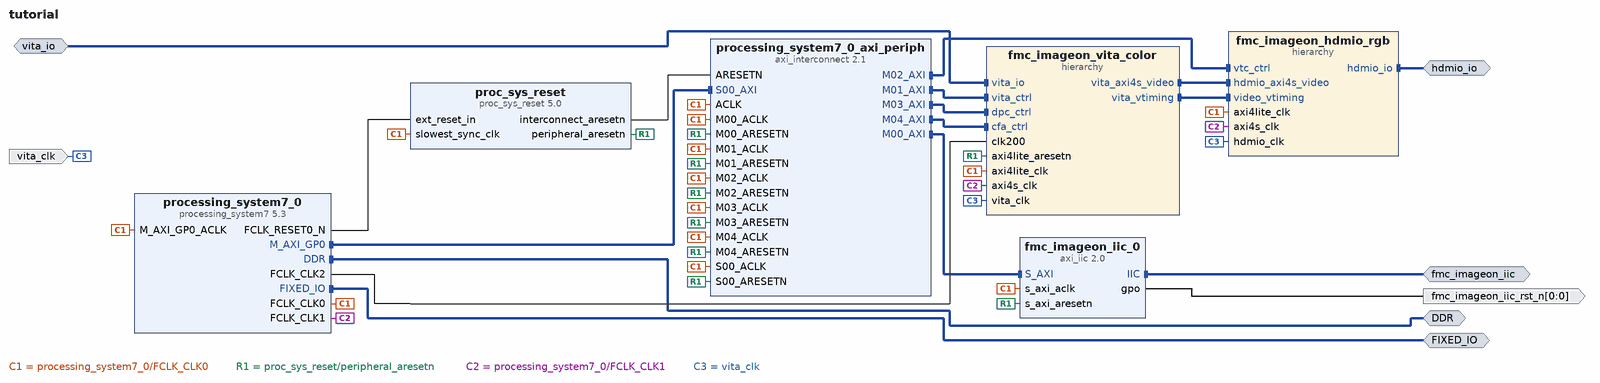
[diagram p0: block diagram of the top level]
# Vivado block design tutorial, Vivado 2013.3
create_bd_design tutorial

create_bd_intf_port -mode Master -vlnv xilinx.com:interface:ddrx_rtl:1.0 DDR
create_bd_intf_port -mode Master -vlnv xilinx.com:display_processing_system7:fixedio_rtl:1.0 FIXED_IO
create_bd_intf_port -mode Master -vlnv xilinx.com:interface:iic_rtl:1.0 fmc_imageon_iic
create_bd_intf_port -mode Slave -vlnv avnet.com:interface:avnet_vita_rtl:1.0 vita_io
create_bd_intf_port -mode Master -vlnv avnet.com:interface:avnet_hdmi_rtl:1.0 hdmio_io
create_bd_port -dir O -from 0 -to 0 fmc_imageon_iic_rst_n
create_bd_port -dir I vita_clk

create_bd_cell -type ip -vlnv xilinx.com:ip:processing_system7:5.3 processing_system7_0
set_property -dict [list \
  CONFIG.PCW_FPGA1_PERIPHERAL_FREQMHZ 150 \
  CONFIG.PCW_FPGA2_PERIPHERAL_FREQMHZ 200 \
  CONFIG.PCW_EN_CLK1_PORT 1 \
  CONFIG.PCW_EN_CLK2_PORT 1 \
  CONFIG.preset {ZC702*} \
] [get_bd_cells processing_system7_0]
create_bd_cell -type ip -vlnv xilinx.com:ip:axi_iic:2.0 fmc_imageon_iic_0
set_property -dict {CONFIG.USE_BOARD_FLOW true CONFIG.IIC_BOARD_INTERFACE Custom} [get_bd_cells fmc_imageon_iic_0]
create_bd_cell -type ip -vlnv xilinx.com:ip:axi_interconnect:2.1 processing_system7_0_axi_periph
set_property -dict {CONFIG.NUM_MI 5} [get_bd_cells processing_system7_0_axi_periph]
create_bd_cell -type ip -vlnv xilinx.com:ip:proc_sys_reset:5.0 proc_sys_reset
create_bd_cell -type hier fmc_imageon_vita_color
create_bd_cell -type hier fmc_imageon_hdmio_rgb

# ---- hierarchy /fmc_imageon_vita_color ----
current_bd_instance /fmc_imageon_vita_color
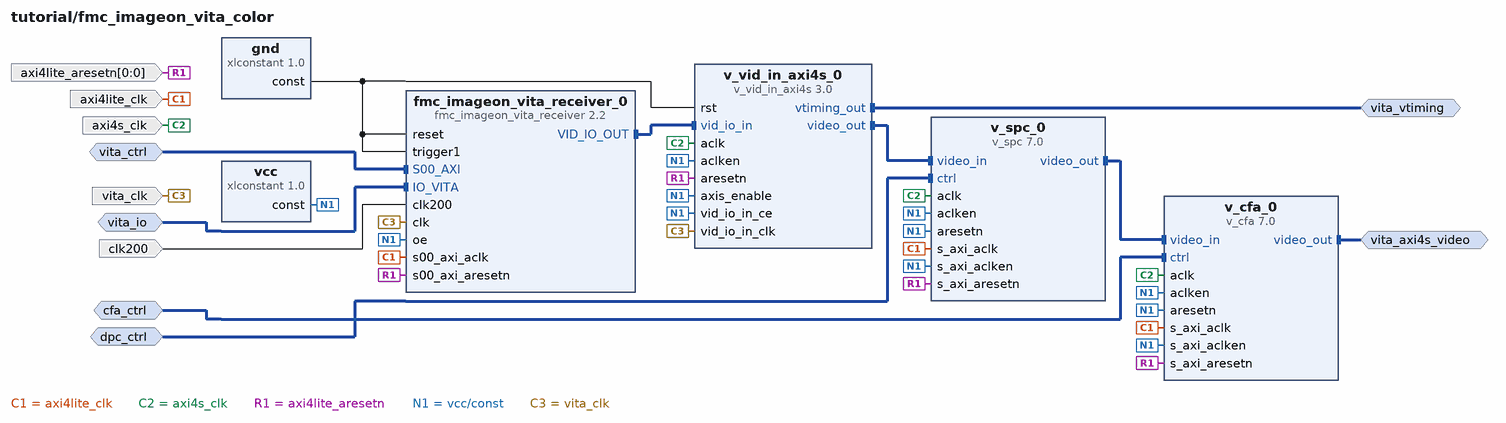
[diagram p1: block diagram inside /fmc_imageon_vita_color]
create_bd_intf_pin -mode Slave -vlnv xilinx.com:interface:aximm_rtl:1.0 cfa_ctrl
create_bd_intf_pin -mode Slave -vlnv xilinx.com:interface:aximm_rtl:1.0 dpc_ctrl
create_bd_intf_pin -mode Master -vlnv xilinx.com:interface:axis_rtl:1.0 vita_axi4s_video
create_bd_intf_pin -mode Slave -vlnv xilinx.com:interface:aximm_rtl:1.0 vita_ctrl
create_bd_intf_pin -mode Slave -vlnv avnet.com:interface:avnet_vita_rtl:1.0 vita_io
create_bd_intf_pin -mode Master -vlnv xilinx.com:interface:video_timing_rtl:2.0 vita_vtiming
create_bd_pin -dir I -from 0 -to 0 -type rst axi4lite_aresetn
create_bd_pin -dir I -type clk axi4lite_clk
create_bd_pin -dir I -type clk axi4s_clk
create_bd_pin -dir I clk200
create_bd_pin -dir I vita_clk

create_bd_cell -type ip -vlnv xilinx.com:ip:xlconstant:1.0 gnd
set_property -dict {CONFIG.CONST_VAL 0} [get_bd_cells gnd]
create_bd_cell -type ip -vlnv xilinx.com:ip:v_cfa:7.0 v_cfa_0
set_property -dict {CONFIG.has_axi4_lite true} [get_bd_cells v_cfa_0]
create_bd_cell -type ip -vlnv xilinx.com:ip:v_spc:7.0 v_spc_0
set_property -dict {CONFIG.has_axi4_lite true} [get_bd_cells v_spc_0]
create_bd_cell -type ip -vlnv xilinx.com:ip:v_vid_in_axi4s:3.0 v_vid_in_axi4s_0
set_property -dict {CONFIG.C_M_AXIS_VIDEO_FORMAT 12} [get_bd_cells v_vid_in_axi4s_0]
create_bd_cell -type ip -vlnv xilinx.com:ip:xlconstant:1.0 vcc
create_bd_cell -type ip -vlnv avnet:fmc_imageon:fmc_imageon_vita_receiver:2.2 fmc_imageon_vita_receiver_0
set_property -dict {CONFIG.C_VIDEO_DATA_WIDTH 8 CONFIG.C_DEBUG_PORT false} [get_bd_cells fmc_imageon_vita_receiver_0]

# ---- hierarchy /fmc_imageon_hdmio_rgb ----
current_bd_instance /fmc_imageon_hdmio_rgb
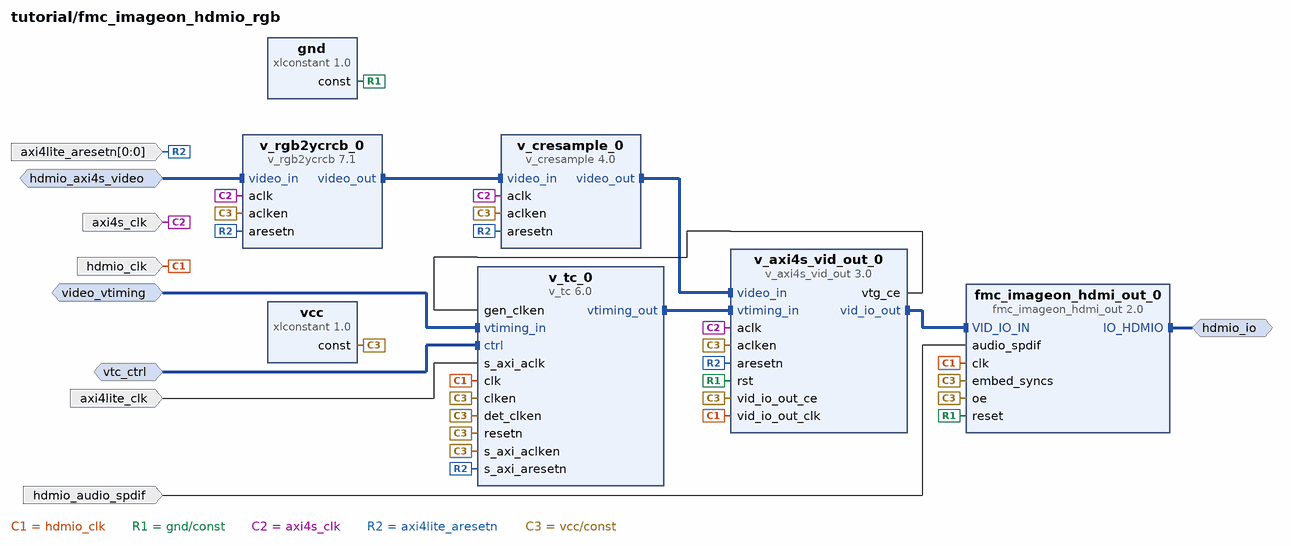
[diagram p2: block diagram inside /fmc_imageon_hdmio_rgb]
create_bd_intf_pin -mode Slave -vlnv xilinx.com:interface:axis_rtl:1.0 hdmio_axi4s_video
create_bd_intf_pin -mode Master -vlnv avnet.com:interface:avnet_hdmi_rtl:1.0 hdmio_io
create_bd_intf_pin -mode Slave -vlnv xilinx.com:interface:video_timing_rtl:2.0 video_vtiming
create_bd_intf_pin -mode Slave -vlnv xilinx.com:interface:aximm_rtl:1.0 vtc_ctrl
create_bd_pin -dir I -from 0 -to 0 axi4lite_aresetn
create_bd_pin -dir I axi4lite_clk
create_bd_pin -dir I -type clk axi4s_clk
create_bd_pin -dir I hdmio_audio_spdif
create_bd_pin -dir I hdmio_clk

create_bd_cell -type ip -vlnv avnet:fmc_imageon:fmc_imageon_hdmi_out:2.0 fmc_imageon_hdmi_out_0
create_bd_cell -type ip -vlnv xilinx.com:ip:xlconstant:1.0 gnd
set_property -dict {CONFIG.CONST_VAL 0} [get_bd_cells gnd]
create_bd_cell -type ip -vlnv xilinx.com:ip:v_axi4s_vid_out:3.0 v_axi4s_vid_out_0
create_bd_cell -type ip -vlnv xilinx.com:ip:v_cresample:4.0 v_cresample_0
set_property -dict {CONFIG.s_axis_video_format 3 CONFIG.m_axis_video_format 2} [get_bd_cells v_cresample_0]
create_bd_cell -type ip -vlnv xilinx.com:ip:v_rgb2ycrcb:7.1 v_rgb2ycrcb_0
create_bd_cell -type ip -vlnv xilinx.com:ip:v_tc:6.0 v_tc_0
set_property -dict [list \
  CONFIG.VIDEO_MODE 1080p \
  CONFIG.horizontal_sync_detection false \
  CONFIG.auto_generation_mode true \
  CONFIG.vertical_sync_detection false \
] [get_bd_cells v_tc_0]
create_bd_cell -type ip -vlnv xilinx.com:ip:xlconstant:1.0 vcc

# ---- connections ----

current_bd_instance /fmc_imageon_vita_color
connect_bd_intf_net [get_bd_intf_pins fmc_imageon_vita_receiver_0/VID_IO_OUT] [get_bd_intf_pins v_vid_in_axi4s_0/vid_io_in]
connect_bd_intf_net [get_bd_intf_pins v_cfa_0/video_in] [get_bd_intf_pins v_spc_0/video_out]
connect_bd_intf_net [get_bd_intf_pins v_spc_0/video_in] [get_bd_intf_pins v_vid_in_axi4s_0/video_out]
connect_bd_intf_net [get_bd_intf_pins cfa_ctrl] [get_bd_intf_pins v_cfa_0/ctrl]
connect_bd_intf_net [get_bd_intf_pins dpc_ctrl] [get_bd_intf_pins v_spc_0/ctrl]
connect_bd_intf_net [get_bd_intf_pins vita_axi4s_video] [get_bd_intf_pins v_cfa_0/video_out]
connect_bd_intf_net [get_bd_intf_pins vita_ctrl] [get_bd_intf_pins fmc_imageon_vita_receiver_0/S00_AXI]
connect_bd_intf_net [get_bd_intf_pins vita_io] [get_bd_intf_pins fmc_imageon_vita_receiver_0/IO_VITA]
connect_bd_intf_net [get_bd_intf_pins vita_vtiming] [get_bd_intf_pins v_vid_in_axi4s_0/vtiming_out]
connect_bd_net -net clk_fpga_0 [get_bd_pins axi4lite_clk] \
  [get_bd_pins v_cfa_0/s_axi_aclk] [get_bd_pins v_spc_0/s_axi_aclk] [get_bd_pins fmc_imageon_vita_receiver_0/s00_axi_aclk]
connect_bd_net -net clk_fpga_1 [get_bd_pins clk200] [get_bd_pins fmc_imageon_vita_receiver_0/clk200]
connect_bd_net -net clk_fpga_2 [get_bd_pins axi4s_clk] [get_bd_pins v_cfa_0/aclk] [get_bd_pins v_spc_0/aclk] [get_bd_pins v_vid_in_axi4s_0/aclk]
connect_bd_net [get_bd_pins gnd/const] \
  [get_bd_pins v_vid_in_axi4s_0/rst] [get_bd_pins fmc_imageon_vita_receiver_0/reset] \
  [get_bd_pins fmc_imageon_vita_receiver_0/trigger1]
connect_bd_net -net proc_sys_reset_peripheral_aresetn [get_bd_pins axi4lite_aresetn] \
  [get_bd_pins v_cfa_0/s_axi_aresetn] [get_bd_pins v_spc_0/s_axi_aresetn] [get_bd_pins v_vid_in_axi4s_0/aresetn] \
  [get_bd_pins fmc_imageon_vita_receiver_0/s00_axi_aresetn]
connect_bd_net [get_bd_pins vcc/const] \
  [get_bd_pins v_cfa_0/aclken] [get_bd_pins v_cfa_0/aresetn] [get_bd_pins v_cfa_0/s_axi_aclken] [get_bd_pins v_spc_0/aclken] \
  [get_bd_pins v_spc_0/aresetn] [get_bd_pins v_spc_0/s_axi_aclken] [get_bd_pins v_vid_in_axi4s_0/aclken] \
  [get_bd_pins v_vid_in_axi4s_0/axis_enable] [get_bd_pins v_vid_in_axi4s_0/vid_io_in_ce] \
  [get_bd_pins fmc_imageon_vita_receiver_0/oe]
connect_bd_net -net video_clk_div4 [get_bd_pins vita_clk] [get_bd_pins v_vid_in_axi4s_0/vid_io_in_clk] [get_bd_pins fmc_imageon_vita_receiver_0/clk]

current_bd_instance /fmc_imageon_hdmio_rgb
connect_bd_intf_net [get_bd_intf_pins fmc_imageon_hdmi_out_0/VID_IO_IN] [get_bd_intf_pins v_axi4s_vid_out_0/vid_io_out]
connect_bd_intf_net [get_bd_intf_pins v_axi4s_vid_out_0/video_in] [get_bd_intf_pins v_cresample_0/video_out]
connect_bd_intf_net [get_bd_intf_pins v_cresample_0/video_in] [get_bd_intf_pins v_rgb2ycrcb_0/video_out]
connect_bd_intf_net [get_bd_intf_pins v_axi4s_vid_out_0/vtiming_in] [get_bd_intf_pins v_tc_0/vtiming_out]
connect_bd_intf_net [get_bd_intf_pins hdmio_axi4s_video] [get_bd_intf_pins v_rgb2ycrcb_0/video_in]
connect_bd_intf_net [get_bd_intf_pins hdmio_io] [get_bd_intf_pins fmc_imageon_hdmi_out_0/IO_HDMIO]
connect_bd_intf_net [get_bd_intf_pins video_vtiming] [get_bd_intf_pins v_tc_0/vtiming_in]
connect_bd_intf_net [get_bd_intf_pins vtc_ctrl] [get_bd_intf_pins v_tc_0/ctrl]
connect_bd_net -net clk_1 [get_bd_pins hdmio_clk] \
  [get_bd_pins fmc_imageon_hdmi_out_0/clk] [get_bd_pins v_axi4s_vid_out_0/vid_io_out_clk] [get_bd_pins v_tc_0/clk]
connect_bd_net -net fmc_imageon_hdmi_in_0_audio_spdif [get_bd_pins hdmio_audio_spdif] [get_bd_pins fmc_imageon_hdmi_out_0/audio_spdif]
connect_bd_net [get_bd_pins gnd/const] [get_bd_pins fmc_imageon_hdmi_out_0/reset] [get_bd_pins v_axi4s_vid_out_0/rst]
connect_bd_net -net processing_system7_0_fclk_clk1 [get_bd_pins axi4s_clk] \
  [get_bd_pins v_axi4s_vid_out_0/aclk] [get_bd_pins v_cresample_0/aclk] [get_bd_pins v_rgb2ycrcb_0/aclk]
connect_bd_net -net s_axi_aclk_1 [get_bd_pins axi4lite_clk] [get_bd_pins v_tc_0/s_axi_aclk]
connect_bd_net -net s_axi_aresetn_1 [get_bd_pins axi4lite_aresetn] \
  [get_bd_pins v_axi4s_vid_out_0/aresetn] [get_bd_pins v_cresample_0/aresetn] [get_bd_pins v_rgb2ycrcb_0/aresetn] \
  [get_bd_pins v_tc_0/s_axi_aresetn]
connect_bd_net [get_bd_pins v_axi4s_vid_out_0/vtg_ce] [get_bd_pins v_tc_0/gen_clken]
connect_bd_net [get_bd_pins vcc/const] \
  [get_bd_pins fmc_imageon_hdmi_out_0/embed_syncs] [get_bd_pins fmc_imageon_hdmi_out_0/oe] \
  [get_bd_pins v_axi4s_vid_out_0/aclken] [get_bd_pins v_axi4s_vid_out_0/vid_io_out_ce] [get_bd_pins v_cresample_0/aclken] \
  [get_bd_pins v_rgb2ycrcb_0/aclken] [get_bd_pins v_tc_0/clken] [get_bd_pins v_tc_0/det_clken] [get_bd_pins v_tc_0/resetn] \
  [get_bd_pins v_tc_0/s_axi_aclken]

current_bd_instance /
connect_bd_intf_net [get_bd_intf_pins processing_system7_0/M_AXI_GP0] [get_bd_intf_pins processing_system7_0_axi_periph/S00_AXI]
connect_bd_intf_net [get_bd_intf_pins processing_system7_0_axi_periph/M00_AXI] [get_bd_intf_pins fmc_imageon_iic_0/S_AXI]
connect_bd_intf_net [get_bd_intf_pins processing_system7_0_axi_periph/M01_AXI] [get_bd_intf_pins fmc_imageon_vita_color/vita_ctrl]
connect_bd_intf_net [get_bd_intf_pins processing_system7_0_axi_periph/M02_AXI] [get_bd_intf_pins fmc_imageon_hdmio_rgb/vtc_ctrl]
connect_bd_intf_net [get_bd_intf_pins processing_system7_0_axi_periph/M03_AXI] [get_bd_intf_pins fmc_imageon_vita_color/dpc_ctrl]
connect_bd_intf_net [get_bd_intf_pins processing_system7_0_axi_periph/M04_AXI] [get_bd_intf_pins fmc_imageon_vita_color/cfa_ctrl]
connect_bd_intf_net [get_bd_intf_pins fmc_imageon_vita_color/vita_axi4s_video] [get_bd_intf_pins fmc_imageon_hdmio_rgb/hdmio_axi4s_video]
connect_bd_intf_net [get_bd_intf_pins fmc_imageon_vita_color/vita_vtiming] [get_bd_intf_pins fmc_imageon_hdmio_rgb/video_vtiming]
connect_bd_intf_net [get_bd_intf_ports DDR] [get_bd_intf_pins processing_system7_0/DDR]
connect_bd_intf_net [get_bd_intf_ports FIXED_IO] [get_bd_intf_pins processing_system7_0/FIXED_IO]
connect_bd_intf_net [get_bd_intf_ports fmc_imageon_iic] [get_bd_intf_pins fmc_imageon_iic_0/IIC]
connect_bd_intf_net [get_bd_intf_ports vita_io] [get_bd_intf_pins fmc_imageon_vita_color/vita_io]
connect_bd_intf_net [get_bd_intf_ports hdmio_io] [get_bd_intf_pins fmc_imageon_hdmio_rgb/hdmio_io]
connect_bd_net [get_bd_pins processing_system7_0/FCLK_CLK0] \
  [get_bd_pins processing_system7_0/M_AXI_GP0_ACLK] [get_bd_pins processing_system7_0_axi_periph/S00_ACLK] \
  [get_bd_pins proc_sys_reset/slowest_sync_clk] [get_bd_pins processing_system7_0_axi_periph/ACLK] \
  [get_bd_pins fmc_imageon_iic_0/s_axi_aclk] [get_bd_pins processing_system7_0_axi_periph/M00_ACLK] \
  [get_bd_pins fmc_imageon_vita_color/axi4lite_clk] [get_bd_pins fmc_imageon_hdmio_rgb/axi4lite_clk] \
  [get_bd_pins processing_system7_0_axi_periph/M01_ACLK] [get_bd_pins processing_system7_0_axi_periph/M02_ACLK] \
  [get_bd_pins processing_system7_0_axi_periph/M03_ACLK] [get_bd_pins processing_system7_0_axi_periph/M04_ACLK]
connect_bd_net [get_bd_pins processing_system7_0/FCLK_RESET0_N] [get_bd_pins proc_sys_reset/ext_reset_in]
connect_bd_net [get_bd_pins proc_sys_reset/peripheral_aresetn] \
  [get_bd_pins processing_system7_0_axi_periph/S00_ARESETN] [get_bd_pins fmc_imageon_iic_0/s_axi_aresetn] \
  [get_bd_pins processing_system7_0_axi_periph/M00_ARESETN] [get_bd_pins fmc_imageon_vita_color/axi4lite_aresetn] \
  [get_bd_pins processing_system7_0_axi_periph/M01_ARESETN] [get_bd_pins processing_system7_0_axi_periph/M02_ARESETN] \
  [get_bd_pins processing_system7_0_axi_periph/M03_ARESETN] [get_bd_pins processing_system7_0_axi_periph/M04_ARESETN]
connect_bd_net [get_bd_pins proc_sys_reset/interconnect_aresetn] [get_bd_pins processing_system7_0_axi_periph/ARESETN]
connect_bd_net [get_bd_pins fmc_imageon_iic_0/gpo] [get_bd_ports fmc_imageon_iic_rst_n]
connect_bd_net -net axi4s_clk_1 [get_bd_pins processing_system7_0/FCLK_CLK1] \
  [get_bd_pins fmc_imageon_vita_color/axi4s_clk] [get_bd_pins fmc_imageon_hdmio_rgb/axi4s_clk]
connect_bd_net -net clk200_1 [get_bd_pins processing_system7_0/FCLK_CLK2] [get_bd_pins fmc_imageon_vita_color/clk200]
connect_bd_net [get_bd_ports vita_clk] [get_bd_pins fmc_imageon_vita_color/vita_clk] [get_bd_pins fmc_imageon_hdmio_rgb/hdmio_clk]

# ---- address map ----
assign_bd_address -offset 0x41600000 -range 64K -target_address_space [get_bd_addr_spaces processing_system7_0/Data] [get_bd_addr_segs fmc_imageon_iic_0/S_AXI/Reg]
assign_bd_address -offset 0x43C00000 -range 64K -target_address_space [get_bd_addr_spaces processing_system7_0/Data] [get_bd_addr_segs fmc_imageon_vita_color/fmc_imageon_vita_receiver_0/S00_AXI/Reg]
assign_bd_address -offset 0x43C10000 -range 64K -target_address_space [get_bd_addr_spaces processing_system7_0/Data] [get_bd_addr_segs fmc_imageon_hdmio_rgb/v_tc_0/ctrl/Reg]
assign_bd_address -offset 0x43C20000 -range 64K -target_address_space [get_bd_addr_spaces processing_system7_0/Data] [get_bd_addr_segs fmc_imageon_vita_color/v_spc_0/ctrl/Reg]
assign_bd_address -offset 0x43C30000 -range 64K -target_address_space [get_bd_addr_spaces processing_system7_0/Data] [get_bd_addr_segs fmc_imageon_vita_color/v_cfa_0/ctrl/Reg]

validate_bd_design
save_bd_design
